# Altium schematic sheet Power_Supply.SchDoc (part 2 of 3)
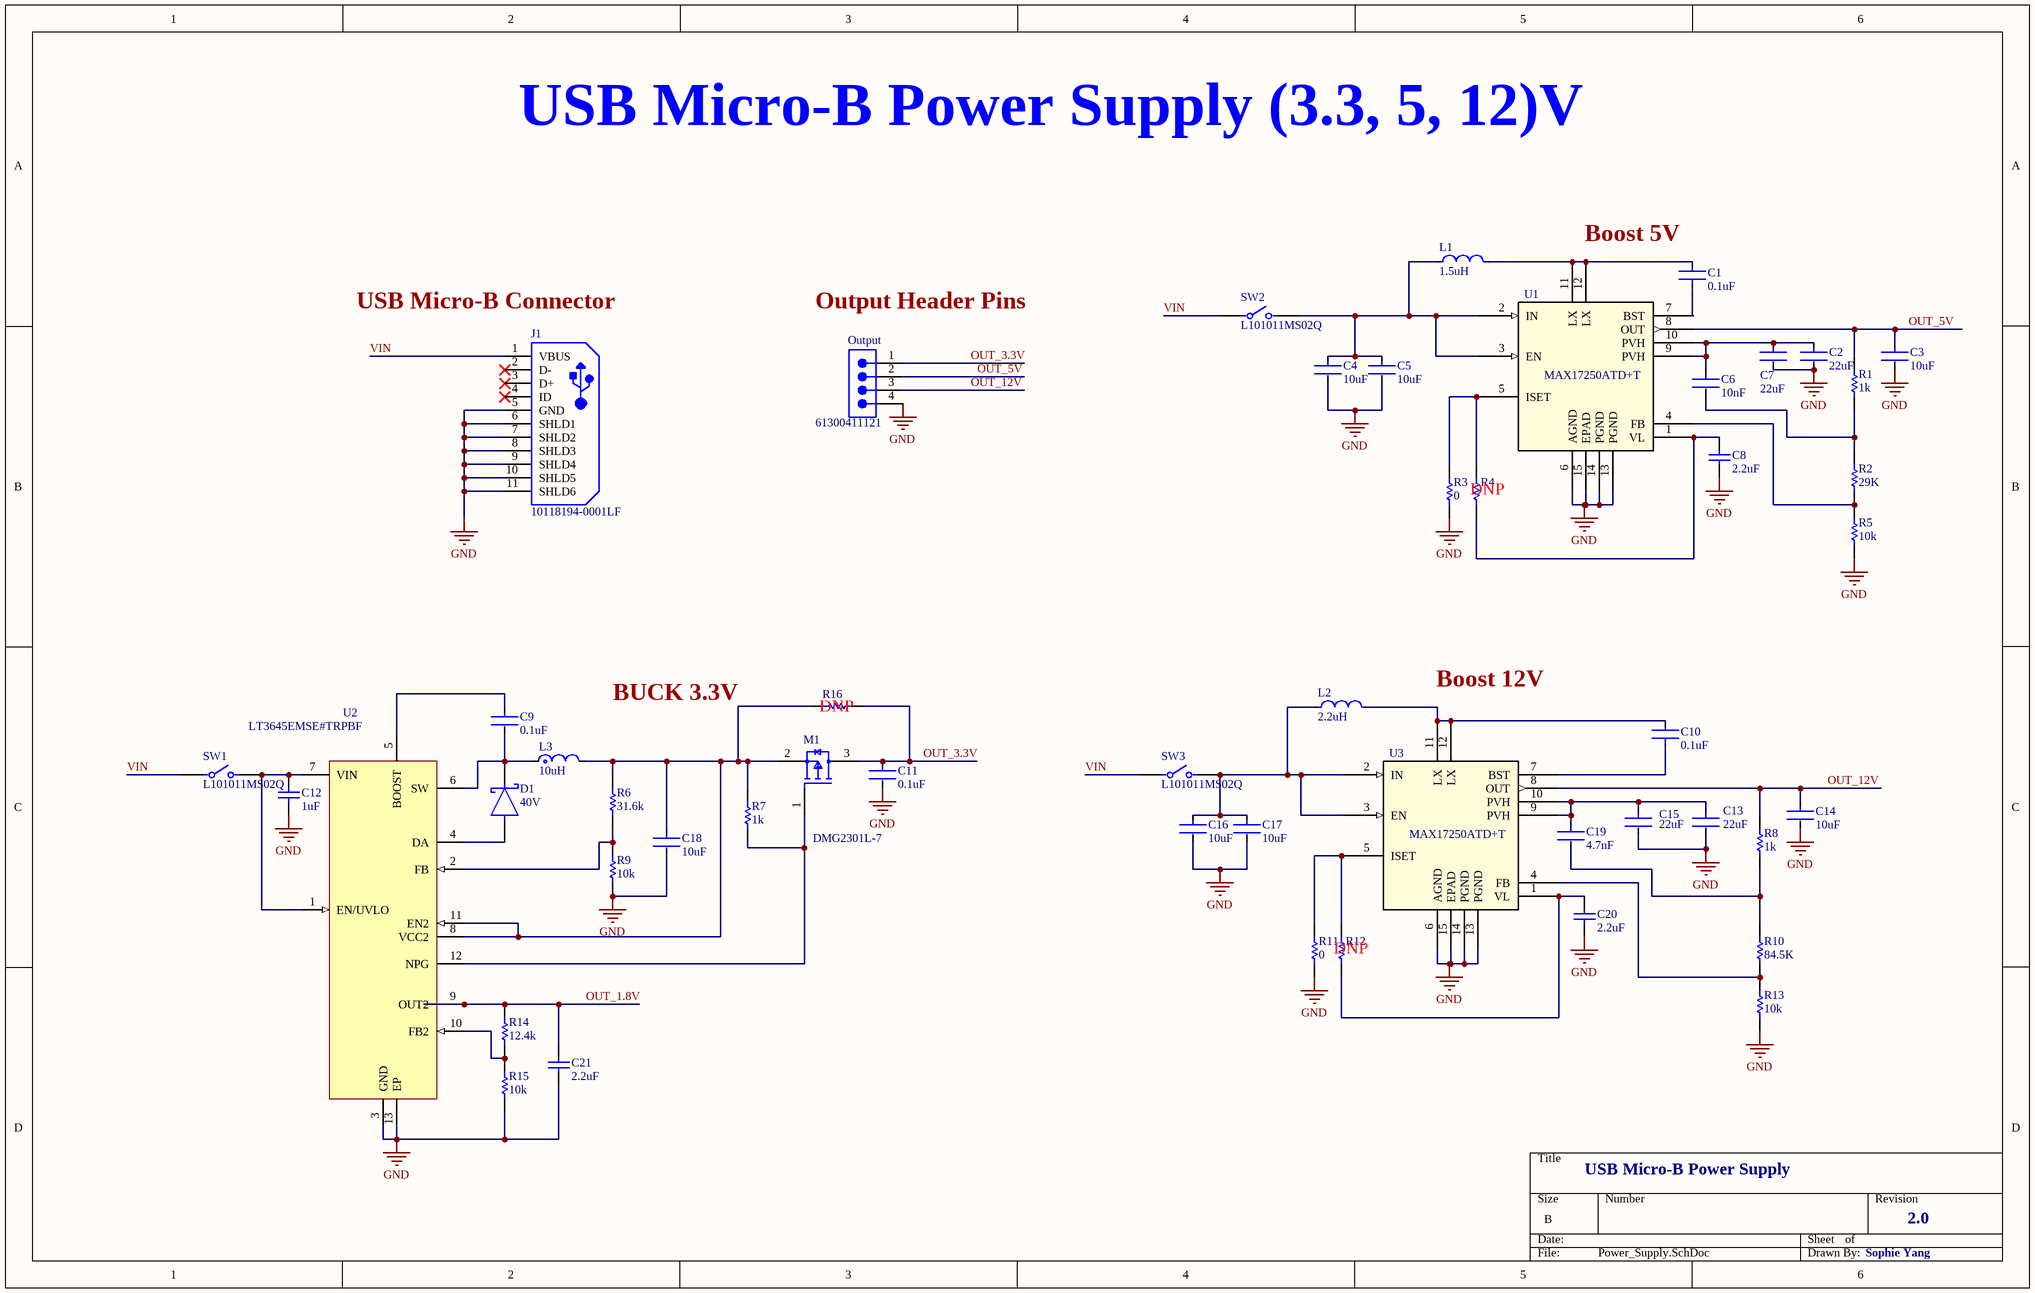
[diagram p1: Power_Supply.SchDoc]
## Library data of the parts
C1 C9-C11 = CC0805KRX7R9BB104: Ceramic Capacitor, Multilayer, Ceramic, 50V, 10% +Tol, 10% -Tol, X7R, 15% TC, 0.1uF, Surface Mount, 0805; Manufacturer: Yageo; Value: 100nF; Multilayer: Yes; Supplier: Digikey; Supplier Part Number: 311-1140-1-ND; Manufacturer Part Number: CC0805KRX7R9BB104; RoHS: Yes; Category: Ceramic Capacitors; Stock: 2371634; Pricing: 1=0.08, 10=0.027, 100=0.0192, 1000=0.0136, 4000=0.01025 (USD); Mounting Technology: Surface Mount; Pins: 2; Dielectric Material: Ceramic; Package Shape: Rectangular; Case/Package: 0805; Terminal Finish: Nickel; Min Operating Temperature: -55°C; Max Operating Temperature: 125°C; JESD-609 Code: e3; Capacitor Type: Ceramic; Tolerance  (fill in as +-): 10%; Package Style: SMTMeter; Packaging: Tape and Reel; Tolerance (fill in as +-): 10%; Rated DC Voltage (URdc): 50V; Temperature Characteristics Code: X7R; Termination: Wraparound; Length: 2mm; Width: 1.25mm; Height: 0.85mm; Reach SVHC Compliant: Yes; RoHS Compliant: Yes; ComponentLink1URL: https://datasheet.ciiva.com:443/pdfs/VipMasterIC/IC/YAGO/YAGO-S-A0003557223/YAGO-S-A0003557223-1.pdf?src-supplier=IHS+Markit; ComponentLink1Description: https://datasheet.ciiva.com:443/pdfs/VipMasterIC/IC/YAGO/YAGO-S-A0003557223/YAGO-S-A0003557223-1.pdf?src-supplier=IHS+Markit; ComponentLink2URL: https://datasheet.ciiva.com/11786/0900766b80d84f1d-11786009.pdf?src-supplier=Rs; ComponentLink2Description: https://datasheet.ciiva.com/11786/0900766b80d84f1d-11786009.pdf?src-supplier=Rs; ComponentLink3URL: https://datasheet.ciiva.com/155/mlccorderingcode-155929.pdf?src-supplier=Digikey; ComponentLink3Description: https://datasheet.ciiva.com/155/mlccorderingcode-155929.pdf?src-supplier=Digikey; ComponentLink4URL: https://datasheet.ciiva.com/155/mlccorderingcode-155930.pdf?src-supplier=Digikey; ComponentLink4Description: https://datasheet.ciiva.com/155/mlccorderingcode-155930.pdf?src-supplier=Digikey; ComponentLink5URL: https://datasheet.ciiva.com/155/mlccorderingcode-155931.pdf?src-supplier=Digikey; ComponentLink5Description: https://datasheet.ciiva.com/155/mlccorderingcode-155931.pdf?src-supplier=Digikey; ComponentLink6URL: https://datasheet.ciiva.com/46393/1734573-46393307.pdf?src-supplier=Element14; ComponentLink6Description: https://datasheet.ciiva.com/46393/1734573-46393307.pdf?src-supplier=Element14; ComponentLink7URL: https://datasheet.ciiva.com/28450/1489800-28450805.pdf?src-supplier=Element14; ComponentLink7Description: https://datasheet.ciiva.com/28450/1489800-28450805.pdf?src-supplier=Element14; ComponentLink8URL: https://datasheet.ciiva.com/29242/445210-da-01-en-kerko-chip-0805-x7r-0-1uf-10proz-50vg-29242074.pdf?src-supplier=Conrad; ComponentLink8Description: https://datasheet.ciiva.com/29242/445210-da-01-en-kerko-chip-0805-x7r-0-1uf-10proz-50vg-29242074.pdf?src-supplier=Conrad; LCSC Part Number: C49678; Supplier 1: Digikey; Supplier Part Number 1: 311-1140-1-ND
C2 C7 = GRM21BR61C226ME44L: CAP CER 22UF 16V X5R 0805; Manufacturer: Murata; Dielectric Material: Ceramic; Multilayer: Yes; Tolerance  (fill in as +-): 20%; Supplier: Digikey; Supplier Part Number: 490-10747-1-ND; Manufacturer Part Number: GRM21BR61C226ME44L; RoHS: Yes; Category: Ceramic Capacitors; Stock: 146152; Pricing: 1=0.31, 10=0.182, 100=0.1179, 1000=0.0846, 3000=0.07641, 6000=0.07158, 9000=0.06916, 15000=0.06648, 21000=0.06491, 30000=0.06341, 75000=0.06016, 150000=0.0582 (USD); Mounting Technology: Surface Mount; Pins: 2; Package Shape: Rectangular; Case/Package: 0805; Terminal Finish: Nickel; Min Operating Temperature: -55°C; Max Operating Temperature: 85°C; JESD-609 Code: e3; Value: 22uF; Capacitor Type: Ceramic; Package Style: SMTMeter; Packaging: Tape and Reel; Tolerance (fill in as +-): 20%; Rated DC Voltage (URdc): 16V; Temperature Characteristics Code: X5R; Termination: Wraparound; Length: 2mm; Width: 1.25mm; Height: 1.25mm; Reach SVHC Compliant: Yes; RoHS Compliant: Yes; ComponentLink1URL: https://datasheet.ciiva.com:443/pdfs/VipMasterIC/IC/MURE/MURE-S-A0004349797/MURE-S-A0004361391-1.pdf?src-supplier=IHS+Markit; ComponentLink1Description: https://datasheet.ciiva.com:443/pdfs/VipMasterIC/IC/MURE/MURE-S-A0004349797/MURE-S-A0004361391-1.pdf?src-supplier=IHS+Markit; ComponentLink2URL: http://www.farnell.com/datasheets/2189139.pdf?src-supplier=Farnell; ComponentLink2Description: http://www.farnell.com/datasheets/2189139.pdf?src-supplier=Farnell; ComponentLink3URL: http://www.mouser.com/ds/2/281/c02e-2905.pdf?src-supplier=Mouser; ComponentLink3Description: http://www.mouser.com/ds/2/281/c02e-2905.pdf?src-supplier=Mouser; ComponentLink4URL: http://www.farnell.com/datasheets/2189139.pdf?src-supplier=Element14; ComponentLink4Description: http://www.farnell.com/datasheets/2189139.pdf?src-supplier=Element14; ComponentLink5URL: http://www.farnell.com/datasheets/2189139.pdf?src-supplier=Newark; ComponentLink5Description: http://www.farnell.com/datasheets/2189139.pdf?src-supplier=Newark; ComponentLink6URL: https://datasheet.octopart.com/GRM21BR61C226ME44L-Murata-datasheet-68590480.pdf?src-supplier=Newark; ComponentLink6Description: https://datasheet.octopart.com/GRM21BR61C226ME44L-Murata-datasheet-68590480.pdf?src-supplier=Newark; ComponentLink7URL: https://search.murata.co.jp/Ceramy/image/img/A01X/G101/ENG/GRM21BR61C226ME44-01.pdf?src-supplier=Digikey; ComponentLink7Description: https://search.murata.co.jp/Ceramy/image/img/A01X/G101/ENG/GRM21BR61C226ME44-01.pdf?src-supplier=Digikey; ComponentLink8URL: http://psearch.en.murata.com/capacitor/product/GRM21BR61C226ME44%23.pdf?src-supplier=Avnet; ComponentLink8Description: http://psearch.en.murata.com/capacitor/product/GRM21BR61C226ME44%23.pdf?src-supplier=Avnet; ComponentLink9URL: https://datasheet.octopart.com/GRM21BR61C226ME44L-Murata-datasheet-149523492.pdf?src-supplier=Farnell; ComponentLink9Description: https://datasheet.octopart.com/GRM21BR61C226ME44L-Murata-datasheet-149523492.pdf?src-supplier=Farnell; ComponentLink10URL: https://datasheet.octopart.com/GRM21BR61C226ME44L-Murata-datasheet-79626383.pdf?src-supplier=Future+Electronics; ComponentLink10Description: https://datasheet.octopart.com/GRM21BR61C226ME44L-Murata-datasheet-79626383.pdf?src-supplier=Future+Electronics; ComponentLink11URL: https://datasheet.octopart.com/GRM21BR61C226ME44L-Murata-datasheet-165579666.pdf?src-supplier=TME; ComponentLink11Description: https://datasheet.octopart.com/GRM21BR61C226ME44L-Murata-datasheet-165579666.pdf?src-supplier=TME; LCSC Part Number: C86817; Supplier 1: Digikey; Supplier Part Number 1: 490-10747-1-ND
C3-C5 C16-C18 = GRM21BR61C106KE15K: Ceramic Capacitor, Multilayer, Ceramic, 16V, 10% +Tol, 10% -Tol, X5R, 15% TC, 10uF, Surface Mount, 0805; Manufacturer: Murata; Multilayer: Yes; Supplier: Digikey; Supplier Part Number: 490-6473-1-ND; Manufacturer Part Number: GRM21BR61C106KE15K; RoHS: Yes; Category: Ceramic Capacitors; Stock: 930907; Pricing: 1=0.14, 10=0.081, 100=0.0497, 1000=0.03306, 2500=0.0261 (USD); Mounting Technology: Surface Mount; Pins: 2; Dielectric Material: Ceramic; Package Shape: Rectangular; Case/Package: 0805; Terminal Finish: Nickel; Min Operating Temperature: -55°C; Max Operating Temperature: 85°C; JESD-609 Code: e3; Value: 10uF; Capacitor Type: Ceramic; Tolerance  (fill in as +-): 10%; Package Style: SMTMeter; Packaging: Tape and Reel; Tolerance (fill in as +-): 10%; Rated DC Voltage (URdc): 16V; Temperature Characteristics Code: X5R; Termination: Wraparound; Length: 2mm; Width: 1.25mm; Height: 1.25mm; Reach SVHC Compliant: Yes; RoHS Compliant: Yes; ComponentLink1URL: https://psearch.en.murata.com:443/capacitor/product/GRM21BR61C106KE15%23.pdf?src-supplier=IHS+Markit; ComponentLink1Description: https://psearch.en.murata.com:443/capacitor/product/GRM21BR61C106KE15%23.pdf?src-supplier=IHS+Markit; ComponentLink2URL: https://datasheet.ciiva.com/6270/partnumbering-e-01-6270407.pdf?src-supplier=Digikey; ComponentLink2Description: https://datasheet.ciiva.com/6270/partnumbering-e-01-6270407.pdf?src-supplier=Digikey; ComponentLink3URL: https://datasheet.ciiva.com/6270/partnumbering-e-01-6270410.pdf?src-supplier=Digikey; ComponentLink3Description: https://datasheet.ciiva.com/6270/partnumbering-e-01-6270410.pdf?src-supplier=Digikey; ComponentLink4URL: https://datasheet.ciiva.com/6270/partnumbering-e-01-6270412.pdf?src-supplier=Digikey; ComponentLink4Description: https://datasheet.ciiva.com/6270/partnumbering-e-01-6270412.pdf?src-supplier=Digikey; ComponentLink5URL: https://datasheet.ciiva.com/5414/product-5414934.pdf?src-supplier=Mouser; ComponentLink5Description: https://datasheet.ciiva.com/5414/product-5414934.pdf?src-supplier=Mouser; LCSC Part Number: C408141
  C3-C5 C16 C17: Supplier 1: Digikey; Supplier Part Number 1: 490-6473-1-ND
C6 = C0805C103K5RAC-TU: Ceramic Capacitor, Multilayer, Ceramic, 50V, 10% +Tol, 10% -Tol, X7R, 15% TC, 0.01uF, Surface Mount, 0805; Manufacturer: KEMET; Multilayer: Yes; Supplier: Digikey; Supplier Part Number: 399-C0805C103K5RACTUCT-ND; Manufacturer Part Number: C0805C103K5RAC-TU; RoHS: Yes; Category: Ceramic Capacitors; Stock: 1437478; Pricing: 1=0.08, 10=0.02, 50=0.0128, 100=0.0122, 4000=0.01 (USD); Mounting Technology: Surface Mount; Pins: 2; Dielectric Material: Ceramic; Package Shape: Rectangular; Case/Package: 0805; Terminal Finish: Nickel; Min Operating Temperature: -55°C; Max Operating Temperature: 125°C; JESD-609 Code: e3; Value: 10nF; Capacitor Type: Ceramic; Tolerance  (fill in as +-): 10%; Package Style: SMTMeter; Packaging: Tape and Reel; Tolerance (fill in as +-): 10%; Rated DC Voltage (URdc): 50V; Temperature Characteristics Code: X7R; Termination: Wraparound; Length: 2mm; Width: 1.25mm; Height: 0.78mm; Reach SVHC Compliant: Yes; RoHS Compliant: Yes; ComponentLink1URL: https://datasheet.ciiva.com:443/pdfs/VipMasterIC/IC/KEME/KEME-S-A0008991654/KEME-S-A0008991654-1.pdf?src-supplier=IHS+Markit; ComponentLink1Description: https://datasheet.ciiva.com:443/pdfs/VipMasterIC/IC/KEME/KEME-S-A0008991654/KEME-S-A0008991654-1.pdf?src-supplier=IHS+Markit; ComponentLink2URL: https://datasheet.ciiva.com/7842/kem-c1002-x7r-smd-7842533.pdf?src-supplier=Element14; ComponentLink2Description: https://datasheet.ciiva.com/7842/kem-c1002-x7r-smd-7842533.pdf?src-supplier=Element14; ComponentLink3URL: https://datasheet.ciiva.com/5904/kem-c1002-x7r-smd-5904709.pdf?src-supplier=Farnell; ComponentLink3Description: https://datasheet.ciiva.com/5904/kem-c1002-x7r-smd-5904709.pdf?src-supplier=Farnell; ComponentLink4URL: https://datasheet.ciiva.com/26923/getdatasheetpartid-759674-26923957.pdf?src-supplier=Verical; ComponentLink4Description: https://datasheet.ciiva.com/26923/getdatasheetpartid-759674-26923957.pdf?src-supplier=Verical; Supplier 1: Digikey; Supplier Part Number 1: 399-C0805C103K5RACTUCT-ND
C8 C20 C21 = C0805C225M8RACTU: CAP CER 2.2UF 10V X7R 0805; Manufacturer: KEMET; Dielectric Material: Ceramic; Multilayer: Yes; Tolerance  (fill in as +-): 20%; Supplier: Digikey; Supplier Part Number: 399-C0805C225M8RACTUCT-ND; Manufacturer Part Number: C0805C225M8RACTU; RoHS: Yes; Category: Ceramic Capacitors; Stock: 10401; Pricing: 1=0.22, 10=0.128, 100=0.0931, 1000=0.07388 (USD); Mounting Technology: Surface Mount; Pins: 2; Case/Package: 0805; Terminal Finish: Nickel; Package Shape: Rectangular; Min Operating Temperature: -55°C; Max Operating Temperature: 125°C; JESD-609 Code: e3; Value: 2.2uF; Capacitor Type: Ceramic; Package Style: SMTMeter; Packaging: Tape and Reel; Tolerance (fill in as +-): 20%; Rated DC Voltage (URdc): 10V; Temperature Characteristics Code: X7R; Termination: Wraparound; Length: 2mm; Width: 1.25mm; Height: 1.25mm; Reach SVHC Compliant: Yes; RoHS Compliant: Yes; ComponentLink1URL: https://datasheet.ciiva.com:443/pdfs/VipMasterIC/IC/KEME/KEME-S-A0008991654/KEME-S-A0008991654-1.pdf?src-supplier=IHS+Markit; ComponentLink1Description: https://datasheet.ciiva.com:443/pdfs/VipMasterIC/IC/KEME/KEME-S-A0008991654/KEME-S-A0008991654-1.pdf?src-supplier=IHS+Markit; ComponentLink2URL: http://www.farnell.com/datasheets/2750133.pdf?src-supplier=Farnell; ComponentLink2Description: http://www.farnell.com/datasheets/2750133.pdf?src-supplier=Farnell; ComponentLink3URL: http://www.mouser.com/ds/2/212/KEM_C1002_X7R_SMD-1102033.pdf?src-supplier=Mouser; ComponentLink3Description: http://www.mouser.com/ds/2/212/KEM_C1002_X7R_SMD-1102033.pdf?src-supplier=Mouser; ComponentLink4URL: https://api.kemet.com/component-edge/download/datasheet/C0805C225M8RACTU.pdf?src-supplier=Digikey; ComponentLink4Description: https://api.kemet.com/component-edge/download/datasheet/C0805C225M8RACTU.pdf?src-supplier=Digikey; ComponentLink5URL: https://search.kemet.com/component-edge/download/datasheet/C0805C225M8RACTU.pdf?src-supplier=Digikey; ComponentLink5Description: https://search.kemet.com/component-edge/download/datasheet/C0805C225M8RACTU.pdf?src-supplier=Digikey; ComponentLink6URL: http://www.farnell.com/datasheets/2750133.pdf?src-supplier=Newark; ComponentLink6Description: http://www.farnell.com/datasheets/2750133.pdf?src-supplier=Newark; LCSC Part Number: C2170244; Supplier 1: Digikey; Supplier Part Number 1: 399-C0805C225M8RACTUCT-ND
C12 = C0805C105K4RACTU: CAP CER 1UF 16V X7R 0805; Manufacturer: KEMET; Dielectric Material: Ceramic; Multilayer: Yes; Tolerance  (fill in as +-): 10%; Supplier: Digikey; Supplier Part Number: 399-C0805C105K4RACTUCT-ND; Manufacturer Part Number: C0805C105K4RACTU; RoHS: Yes; Category: Ceramic Capacitors; Stock: 337974; Pricing: 1=0.12, 10=0.068, 100=0.041, 1000=0.02906, 2500=0.02182, 5000=0.02051, 7500=0.02038, 12500=0.01866, 17500=0.01858, 25000=0.01823, 62500=0.01685, 125000=0.01633 (USD); Mounting Technology: Surface Mount; Pins: 2; Package Shape: Rectangular; Case/Package: 0805; Terminal Finish: Nickel; Min Operating Temperature: -55°C; Max Operating Temperature: 125°C; JESD-609 Code: e3; Value: 1uF; Capacitor Type: Ceramic; Package Style: SMTMeter; Packaging: Tape and Reel; Tolerance (fill in as +-): 10%; Rated DC Voltage (URdc): 16V; Temperature Characteristics Code: X7R; Termination: Wraparound; Length: 2mm; Width: 1.25mm; Height: 0.9mm; Reach SVHC Compliant: Yes; RoHS Compliant: Yes; ComponentLink1URL: https://datasheet.ciiva.com:443/pdfs/VipMasterIC/IC/KEME/KEME-S-A0008991654/KEME-S-A0008991654-1.pdf?src-supplier=IHS+Markit; ComponentLink1Description: https://datasheet.ciiva.com:443/pdfs/VipMasterIC/IC/KEME/KEME-S-A0008991654/KEME-S-A0008991654-1.pdf?src-supplier=IHS+Markit; ComponentLink2URL: https://datasheet.ciiva.com/6074/1722731-6074364.pdf?src-supplier=Farnell; ComponentLink2Description: https://datasheet.ciiva.com/6074/1722731-6074364.pdf?src-supplier=Farnell; ComponentLink3URL: https://datasheet.ciiva.com/14585/70095383-14585511.pdf?src-supplier=Allied+Electronics; ComponentLink3Description: https://datasheet.ciiva.com/14585/70095383-14585511.pdf?src-supplier=Allied+Electronics; ComponentLink4URL: https://datasheet.ciiva.com/14603/70095383-14603388.pdf?src-supplier=Allied+Electronics; ComponentLink4Description: https://datasheet.ciiva.com/14603/70095383-14603388.pdf?src-supplier=Allied+Electronics; ComponentLink5URL: https://datasheet.ciiva.com/28692/1851736-28692942.pdf?src-supplier=Element14; ComponentLink5Description: https://datasheet.ciiva.com/28692/1851736-28692942.pdf?src-supplier=Element14; Supplier 1: Digikey; Supplier Part Number 1: 399-C0805C105K4RACTUCT-ND
C13 C15 = GRM32ER71E226KE15L: CAP CER 22UF 25V X7R 1210; Manufacturer: Murata; Dielectric Material: Ceramic; Multilayer: Yes; Tolerance  (fill in as +-): 10%; Supplier: Digikey; Supplier Part Number: 490-5313-1-ND; Manufacturer Part Number: GRM32ER71E226KE15L; RoHS: Yes; Category: Ceramic Capacitors; Stock: 83307; Pricing: 1=0.76, 10=0.475, 100=0.33 (USD); Mounting Technology: Surface Mount; Pins: 2; Package Shape: Rectangular; Case/Package: 1210; Terminal Finish: Nickel; Min Operating Temperature: -55°C; Max Operating Temperature: 125°C; JESD-609 Code: e3; Value: 22uF; Capacitor Type: Ceramic; Package Style: SMTMeter; Packaging: Tape and Reel; Tolerance (fill in as +-): 10%; Rated DC Voltage (URdc): 25V; Temperature Characteristics Code: X7R; Termination: Wraparound; Length: 3.2mm; Width: 2.5mm; Height: 2.5mm; Reach SVHC Compliant: Yes; RoHS Compliant: Yes; ComponentLink1URL: https://datasheet.ciiva.com:443/pdfs/VipMasterIC/IC/MURE/MURES185303/MURES186124-1.pdf?src-supplier=IHS+Markit; ComponentLink1Description: https://datasheet.ciiva.com:443/pdfs/VipMasterIC/IC/MURE/MURES185303/MURES186124-1.pdf?src-supplier=IHS+Markit; ComponentLink2URL: https://datasheet.ciiva.com/6072/1697714-6072768.pdf?src-supplier=Farnell; ComponentLink2Description: https://datasheet.ciiva.com/6072/1697714-6072768.pdf?src-supplier=Farnell; ComponentLink3URL: https://datasheet.ciiva.com/3776/2741grm32er71e226ke1523-3776996.pdf?src-supplier=Arrow+Electronics; ComponentLink3Description: https://datasheet.ciiva.com/3776/2741grm32er71e226ke1523-3776996.pdf?src-supplier=Arrow+Electronics; ComponentLink4URL: https://datasheet.ciiva.com/11789/0900766b80ef921d-11789129.pdf?src-supplier=Rs; ComponentLink4Description: https://datasheet.ciiva.com/11789/0900766b80ef921d-11789129.pdf?src-supplier=Rs; ComponentLink5URL: https://datasheet.ciiva.com/16497/product-16497009.pdf?src-supplier=Future+Electronics; ComponentLink5Description: https://datasheet.ciiva.com/16497/product-16497009.pdf?src-supplier=Future+Electronics; ComponentLink6URL: https://datasheet.ciiva.com/175/partnumbering-e-01-175746.pdf?src-supplier=Digikey; ComponentLink6Description: https://datasheet.ciiva.com/175/partnumbering-e-01-175746.pdf?src-supplier=Digikey; ComponentLink7URL: https://datasheet.ciiva.com/175/partnumbering-e-01-175747.pdf?src-supplier=Digikey; ComponentLink7Description: https://datasheet.ciiva.com/175/partnumbering-e-01-175747.pdf?src-supplier=Digikey; ComponentLink8URL: https://datasheet.ciiva.com/175/partnumbering-e-01-175748.pdf?src-supplier=Digikey; ComponentLink8Description: https://datasheet.ciiva.com/175/partnumbering-e-01-175748.pdf?src-supplier=Digikey; ComponentLink9URL: https://datasheet.ciiva.com/22703/1697714-22703397.pdf?src-supplier=Element14; ComponentLink9Description: https://datasheet.ciiva.com/22703/1697714-22703397.pdf?src-supplier=Element14; LCSC Part Number: C21397; Supplier 1: Digikey; Supplier Part Number 1: 490-5313-1-ND
C14 = GRM21BZ71E106KE15L: CAP CER 10UF 25V X7R 0805; Manufacturer: Murata; Dielectric Material: Ceramic; Multilayer: Yes; Tolerance  (fill in as +-): 10%; Supplier: Digikey; Supplier Part Number: 490-GRM21BZ71E106KE15LCT-ND; Manufacturer Part Number: GRM21BZ71E106KE15L; RoHS: Yes; Category: Ceramic Capacitors; Stock: 73360; Pricing: 1=0.29, 10=0.171, 100=0.11, 1000=0.07854 (USD); Mounting Technology: Surface Mount; Pins: 2; Package Shape: Rectangular; Case/Package: 0805; Terminal Finish: Nickel; Min Operating Temperature: -55°C; Max Operating Temperature: 125°C; JESD-609 Code: e3; Value: 10uF; Capacitor Type: Ceramic; Packaging: Tape and Reel; Tolerance (fill in as +-): 10%; Rated DC Voltage (URdc): 25V; Temperature Characteristics Code: X7R; Termination: Wraparound; Reach SVHC Compliant: Yes; RoHS Compliant: Yes; ComponentLink1URL: https://datasheet.ciiva.com:443/pdfs/VipMasterIC/IC/MURE/MURE-S-A0004373697/MURE-S-A0004377414-1.pdf?src-supplier=IHS+Markit; ComponentLink1Description: https://datasheet.ciiva.com:443/pdfs/VipMasterIC/IC/MURE/MURE-S-A0004373697/MURE-S-A0004377414-1.pdf?src-supplier=IHS+Markit; ComponentLink2URL: https://datasheet.octopart.com/GRM21BZ71E106KE15L-Murata-datasheet-165579666.pdf?src-supplier=TME; ComponentLink2Description: https://datasheet.octopart.com/GRM21BZ71E106KE15L-Murata-datasheet-165579666.pdf?src-supplier=TME; LCSC Part Number: C237493; Supplier 1: Digikey; Supplier Part Number 1: 490-GRM21BZ71E106KE15LCT-ND
C19 = CC0805KRX7R9BB472: Ceramic Capacitor, Multilayer, Ceramic, 50V, 10% +Tol, 10% -Tol, X7R, 15% TC, 0.0047uF, Surface Mount, 0805; Manufacturer: Yageo; Multilayer: Yes; Supplier: Digikey; Supplier Part Number: 311-1133-1-ND; Manufacturer Part Number: CC0805KRX7R9BB472; RoHS: Yes; Category: Ceramic Capacitors; Stock: 420837; Pricing: 1=0.1, 10=0.055, 100=0.0327, 1000=0.02132 (USD); Mounting Technology: Surface Mount; Pins: 2; Dielectric Material: Ceramic; Package Shape: Rectangular; Case/Package: 0805; Terminal Finish: Nickel; Min Operating Temperature: -55°C; Max Operating Temperature: 125°C; JESD-609 Code: e3; Value: 4.7nF; Capacitor Type: Ceramic; Tolerance  (fill in as +-): 10%; Package Style: SMTMeter; Packaging: Tape and Reel; Tolerance (fill in as +-): 10%; Rated DC Voltage (URdc): 50V; Temperature Characteristics Code: X7R; Termination: Wraparound; Length: 2mm; Width: 1.25mm; Height: 0.6mm; Reach SVHC Compliant: Yes; RoHS Compliant: Yes; ComponentLink1URL: https://datasheet.ciiva.com:443/pdfs/VipMasterIC/IC/YAGO/YAGO-S-A0003557223/YAGO-S-A0003557223-1.pdf?src-supplier=IHS+Markit; ComponentLink1Description: https://datasheet.ciiva.com:443/pdfs/VipMasterIC/IC/YAGO/YAGO-S-A0003557223/YAGO-S-A0003557223-1.pdf?src-supplier=IHS+Markit; ComponentLink2URL: https://datasheet.ciiva.com/144/mlccorderingcode-144604.pdf?src-supplier=Digikey; ComponentLink2Description: https://datasheet.ciiva.com/144/mlccorderingcode-144604.pdf?src-supplier=Digikey; ComponentLink3URL: https://datasheet.ciiva.com/144/mlccorderingcode-144605.pdf?src-supplier=Digikey; ComponentLink3Description: https://datasheet.ciiva.com/144/mlccorderingcode-144605.pdf?src-supplier=Digikey; ComponentLink4URL: https://datasheet.ciiva.com/144/mlccorderingcode-144606.pdf?src-supplier=Digikey; ComponentLink4Description: https://datasheet.ciiva.com/144/mlccorderingcode-144606.pdf?src-supplier=Digikey; ComponentLink5URL: https://datasheet.ciiva.com/11464/upy-gphc-x7r-6-3v-to-50v-8-11464759.pdf?src-supplier=Avnet; ComponentLink5Description: https://datasheet.ciiva.com/11464/upy-gphc-x7r-6-3v-to-50v-8-11464759.pdf?src-supplier=Avnet; ComponentLink6URL: https://datasheet.ciiva.com/28450/1489800-28450830.pdf?src-supplier=Element14; ComponentLink6Description: https://datasheet.ciiva.com/28450/1489800-28450830.pdf?src-supplier=Element14; LCSC Part Number: C107153; Supplier 1: Digikey; Supplier Part Number 1: 311-1133-1-ND
D1 = B5819WS-TP: Rectifier Diode, Schottky, 1 Phase, 1 Element, 1A, 40V V(RRM), Silicon; Manufacturer: MCC; Package Body Material: Plastic; Number of Elements: 1; Time @ Peak Reflow Temperature-Max (s): 10s; Qualification Status: Not Qualified; Supplier: Digikey; Supplier Part Number: B5819WS-TPMSCT-ND; Manufacturer Part Number: B5819WS-TP; RoHS: Yes; Category: Rectifier Diodes; Stock: 479002; Pricing: 1=0.16, 10=0.106, 100=0.0872, 500=0.06382, 1000=0.05625, 3000=0.04242, 6000=0.04171, 9000=0.03965, 15000=0.02557 (USD); Pins: 2; Diode Element Material: SILICON; Package Shape: Rectangular; Terminal Finish: Tin; JESD-609 Code: e3; Diode Type: RECTIFIER; JESD-30 Code: R-PDSO-G2; Moisture Sensitivity Level: 1; Max Output current: 1A; Package Style: SMALL OUTLINEMeter; Peak Reflow Temperature (Cel): 260°C; Rep Pk Reverse Voltage-Max: 40V; Surface Mount: Yes; Technology: SCHOTTKY; Terminal Form: Gull Wing; Terminal Position: DUAL; Reach SVHC Compliant: Yes; RoHS Compliant: Yes; ComponentLink1URL: https://datasheet.ciiva.com:443/pdfs/VipMasterIC/IC/MCCC/MCCC-S-A0009363180/MCCC-S-A0009374855-1.pdf?src-supplier=IHS+Markit; ComponentLink1Description: https://datasheet.ciiva.com:443/pdfs/VipMasterIC/IC/MCCC/MCCC-S-A0009363180/MCCC-S-A0009374855-1.pdf?src-supplier=IHS+Markit; ComponentLink2URL: https://datasheet.ciiva.com/4715/b5817ws-b5819wssod-323-48861-4715941.pdf?src-supplier=Mouser; ComponentLink2Description: https://datasheet.ciiva.com/4715/b5817ws-b5819wssod-323-48861-4715941.pdf?src-supplier=Mouser; ComponentLink3URL: https://datasheet.ciiva.com/912/b5817ws-b5819wssod-323-912735.pdf?src-supplier=Digikey; ComponentLink3Description: https://datasheet.ciiva.com/912/b5817ws-b5819wssod-323-912735.pdf?src-supplier=Digikey; ComponentLink4URL: https://datasheet.ciiva.com/912/b5817ws-b5819wssod-323-912736.pdf?src-supplier=Digikey; ComponentLink4Description: https://datasheet.ciiva.com/912/b5817ws-b5819wssod-323-912736.pdf?src-supplier=Digikey; ComponentLink5URL: https://datasheet.ciiva.com/912/b5817ws-b5819wssod-323-912737.pdf?src-supplier=Digikey; ComponentLink5Description: https://datasheet.ciiva.com/912/b5817ws-b5819wssod-323-912737.pdf?src-supplier=Digikey; ComponentLink6URL: https://datasheet.ciiva.com/15200/getdatasheetpartid-184930-15200423.pdf?src-supplier=Verical; ComponentLink6Description: https://datasheet.ciiva.com/15200/getdatasheetpartid-184930-15200423.pdf?src-supplier=Verical; Supplier 1: Digikey; Supplier Part Number 1: B5819WS-TPMSCT-ND
J1 = 10118194-0001LF: CONN RCPT USB2.0 MICRO B SMD R/A; Manufacturer: Amphenol ICC / FCI; Supplier: Digikey; Supplier Part Number: 609-4618-1-ND; Manufacturer Part Number: 10118194-0001LF; RoHS: No; Category: LDO; Stock: 22163; Pricing: 1=0.43, 10=0.367, 25=0.3436, 50=0.3272, 100=0.3116, 250=0.29204, 500=0.27808 (USD); Supplier 1: Digikey; Supplier Part Number 1: 609-4618-1-ND
L1 = IHLP2020CZER1R5M11: FIXED IND 1.5UH 7.5A 18.5MOHM SM; Manufacturer: Vishay Dale; Supplier: Digikey; Supplier Part Number: 541-1235-1-ND; Manufacturer Part Number: IHLP2020CZER1R5M11; RoHS: No; Category: Fixed Inductors; Stock: 8329; Pricing: 1=1, 10=0.821, 100=0.6749, 1000=0.5728 (USD); ComponentLink1URL: https://datasheet.ciiva.com:443/pdfs/VipMasterIC/IC/VISH/VISH-S-A0003530167/VISH-S-A0003530167-1.pdf?src-supplier=IHS+Markit; ComponentLink1Description: https://datasheet.ciiva.com:443/pdfs/VipMasterIC/IC/VISH/VISH-S-A0003530167/VISH-S-A0003530167-1.pdf?src-supplier=IHS+Markit; ComponentLink2URL: https://datasheet.ciiva.com/11798/0900766b8102c930-11798359.pdf?src-supplier=Rs; ComponentLink2Description: https://datasheet.ciiva.com/11798/0900766b8102c930-11798359.pdf?src-supplier=Rs; ComponentLink3URL: https://datasheet.ciiva.com/1051/lp20cz11-1051639.pdf?src-supplier=Digikey; ComponentLink3Description: https://datasheet.ciiva.com/1051/lp20cz11-1051639.pdf?src-supplier=Digikey; ComponentLink4URL: https://datasheet.ciiva.com/1051/lp20cz11-1051640.pdf?src-supplier=Digikey; ComponentLink4Description: https://datasheet.ciiva.com/1051/lp20cz11-1051640.pdf?src-supplier=Digikey; ComponentLink5URL: https://datasheet.ciiva.com/1051/lp20cz11-1051641.pdf?src-supplier=Digikey; ComponentLink5Description: https://datasheet.ciiva.com/1051/lp20cz11-1051641.pdf?src-supplier=Digikey; ComponentLink6URL: https://datasheet.ciiva.com/8017/480942-8017214.pdf?src-supplier=Element14; ComponentLink6Description: https://datasheet.ciiva.com/8017/480942-8017214.pdf?src-supplier=Element14; ComponentLink7URL: https://datasheet.ciiva.com/4956/lp20cz11-270739-4956454.pdf?src-supplier=Mouser; ComponentLink7Description: https://datasheet.ciiva.com/4956/lp20cz11-270739-4956454.pdf?src-supplier=Mouser; ComponentLink8URL: https://datasheet.ciiva.com/16390/lp20cz11-16390406.pdf?src-supplier=Future+Electronics; ComponentLink8Description: https://datasheet.ciiva.com/16390/lp20cz11-16390406.pdf?src-supplier=Future+Electronics; Supplier 1: Digikey; Supplier Part Number 1: 541-1235-1-ND
L2 = IHLP2020CZER2R2M11: FIXED IND 2.2UH 6.75A 25MOHM SMD; Manufacturer: Vishay Dale; Supplier: Digikey; Supplier Part Number: 541-1236-1-ND; Manufacturer Part Number: IHLP2020CZER2R2M11; RoHS: No; Category: Fixed Inductors; Stock: 3514; Pricing: 1=0.99, 10=0.817, 100=0.6721, 1000=0.57017 (USD); RoHS Compliant: No; ComponentLink1URL: https://datasheet.ciiva.com:443/pdfs/VipMasterIC/IC/VISH/VISH-S-A0003530167/VISH-S-A0003530167-1.pdf?src-supplier=IHS+Markit; ComponentLink1Description: https://datasheet.ciiva.com:443/pdfs/VipMasterIC/IC/VISH/VISH-S-A0003530167/VISH-S-A0003530167-1.pdf?src-supplier=IHS+Markit; ComponentLink2URL: https://datasheet.ciiva.com/11798/0900766b8102c930-11798352.pdf?src-supplier=Rs; ComponentLink2Description: https://datasheet.ciiva.com/11798/0900766b8102c930-11798352.pdf?src-supplier=Rs; ComponentLink3URL: https://datasheet.ciiva.com/46385/480942-46385615.pdf?src-supplier=Element14; ComponentLink3Description: https://datasheet.ciiva.com/46385/480942-46385615.pdf?src-supplier=Element14; ComponentLink4URL: https://datasheet.ciiva.com/1051/lp20cz11-1051642.pdf?src-supplier=Digikey; ComponentLink4Description: https://datasheet.ciiva.com/1051/lp20cz11-1051642.pdf?src-supplier=Digikey; ComponentLink5URL: https://datasheet.ciiva.com/1051/lp20cz11-1051643.pdf?src-supplier=Digikey; ComponentLink5Description: https://datasheet.ciiva.com/1051/lp20cz11-1051643.pdf?src-supplier=Digikey; ComponentLink6URL: https://datasheet.ciiva.com/1051/lp20cz11-1051644.pdf?src-supplier=Digikey; ComponentLink6Description: https://datasheet.ciiva.com/1051/lp20cz11-1051644.pdf?src-supplier=Digikey; ComponentLink7URL: https://datasheet.ciiva.com/24205/lp20cz11-24205966.pdf?src-supplier=Future+Electronics; ComponentLink7Description: https://datasheet.ciiva.com/24205/lp20cz11-24205966.pdf?src-supplier=Future+Electronics; Supplier 1: Digikey; Supplier Part Number 1: 541-1236-1-ND
L3 = VLS6045EX-100M: FIXED IND 10UH 3.4A 61 MOHM SMD; Manufacturer: TDK; Core Material: Ferrite; Tolerance: 20%; Case/Size Code: 2424; DC Resistance (DCR): 47mR; Inductor Application: POWER INDUCTOR; Inductor Type: GENERAL PURPOSE INDUCTOR; Channels: 1; Shape/Size Description: RECTANGULAR PACKAGE; Shielding: Shielded; Test Frequency: 100kHz; Package Height: 4.5mm; Package Length: 6mm; Supplier: Digikey; Supplier Part Number: 445-173039-1-ND; Manufacturer Part Number: VLS6045EX-100M; RoHS: Yes; Category: Fixed Inductors; Stock: 125364; Pricing: 1=0.34, 10=0.284, 100=0.2333 (USD); Pins: 2; Min Operating Temperature: -40°C; Max Operating Temperature: 105°C; Construction: Rectangular; Inductance-Nom (L): 10uH; Package Style: SMTMeter; Packaging: Tape and Reel; Max Current Rating: 3.4A; Surface Mount: Yes; Terminal Placement: Dual Ended; Termination: One Surface; Package Width: 6mm; Reach SVHC Compliant: Yes; RoHS Compliant: Yes; ComponentLink1URL: https://datasheet.ciiva.com:443/pdfs/VipMasterIC/IC/TDKC/TDKC-S-A0006138306/TDKC-S-A0006138306-1.pdf?src-supplier=IHS+Markit; ComponentLink1Description: https://datasheet.ciiva.com:443/pdfs/VipMasterIC/IC/TDKC/TDKC-S-A0006138306/TDKC-S-A0006138306-1.pdf?src-supplier=IHS+Markit; ComponentLink2URL: http://www.farnell.com/datasheets/2724083.pdf?src-supplier=Farnell; ComponentLink2Description: http://www.farnell.com/datasheets/2724083.pdf?src-supplier=Farnell; ComponentLink3URL: https://media.digikey.com/pdf/Data%20Sheets/TDK%20PDFs/VLS-EX_Series_Br.pdf?src-supplier=Digikey; ComponentLink3Description: https://media.digikey.com/pdf/Data%20Sheets/TDK%20PDFs/VLS-EX_Series_Br.pdf?src-supplier=Digikey; ComponentLink4URL: https://datasheet.octopart.com/VLS6045EX-100M-TDK-datasheet-82987839.pdf?src-supplier=Newark; ComponentLink4Description: https://datasheet.octopart.com/VLS6045EX-100M-TDK-datasheet-82987839.pdf?src-supplier=Newark; ComponentLink5URL: https://product.tdk.com/info/en/catalog/datasheets/inductor_commercial_power_vls6045ex_en.pdf?ref_disty=digikey&src-supplier=Digikey; ComponentLink5Description: https://product.tdk.com/info/en/catalog/datasheets/inductor_commercial_power_vls6045ex_en.pdf?ref_disty=digikey&src-supplier=Digikey; ComponentLink6URL: http://www.farnell.com/datasheets/2724083.pdf?src-supplier=Newark; ComponentLink6Description: http://www.farnell.com/datasheets/2724083.pdf?src-supplier=Newark; ComponentLink7URL: http://www.farnell.com/datasheets/1951810.pdf?src-supplier=Element14; ComponentLink7Description: http://www.farnell.com/datasheets/1951810.pdf?src-supplier=Element14; ComponentLink8URL: https://datasheet.octopart.com/VLS6045EX-100M-TDK-datasheet-60278255.pdf?src-supplier=Future+Electronics; ComponentLink8Description: https://datasheet.octopart.com/VLS6045EX-100M-TDK-datasheet-60278255.pdf?src-supplier=Future+Electronics; Supplier 1: Digikey; Supplier Part Number 1: 445-173039-1-ND
M1 = DMG2301L-7: MOSFET P-CH 20V 3A SOT23; Manufacturer: Diodes; Supplier: Digikey; Supplier Part Number: DMG2301L-7DICT-ND; Manufacturer Part Number: DMG2301L-7; RoHS: Yes; Category: MOSFETs; Stock: 57854; Pricing: 1=0.25, 10=0.157, 100=0.0643, 3000=0.04182, 6000=0.03876, 9000=0.03075 (USD); Reach SVHC Compliant: Yes; RoHS Compliant: Yes; ComponentLink1URL: https://datasheet.ciiva.com:443/pdfs/VipMasterIC/IC/DIOD/DIOD-S-A0002497940/DIOD-S-A0002497940-1.pdf?src-supplier=IHS+Markit; ComponentLink1Description: https://datasheet.ciiva.com:443/pdfs/VipMasterIC/IC/DIOD/DIOD-S-A0002497940/DIOD-S-A0002497940-1.pdf?src-supplier=IHS+Markit; ComponentLink2URL: http://www.farnell.com/datasheets/2814385.pdf?src-supplier=Farnell; ComponentLink2Description: http://www.farnell.com/datasheets/2814385.pdf?src-supplier=Farnell; ComponentLink3URL: http://www.mouser.com/ds/2/115/DMG2301L-959562.pdf?src-supplier=Mouser; ComponentLink3Description: http://www.mouser.com/ds/2/115/DMG2301L-959562.pdf?src-supplier=Mouser; ComponentLink4URL: https://www.diodes.com/assets/Datasheets/DMG2301L.pdf?src-supplier=Digikey; ComponentLink4Description: https://www.diodes.com/assets/Datasheets/DMG2301L.pdf?src-supplier=Digikey; ComponentLink5URL: http://www.farnell.com/datasheets/2814385.pdf?src-supplier=Element14; ComponentLink5Description: http://www.farnell.com/datasheets/2814385.pdf?src-supplier=Element14; ComponentLink6URL: http://www.farnell.com/datasheets/2814385.pdf?src-supplier=Newark; ComponentLink6Description: http://www.farnell.com/datasheets/2814385.pdf?src-supplier=Newark; Supplier 1: Digikey; Supplier Part Number 1: DMG2301L-7DICT-ND
Output = 61300411121: CONN HEADER VERT 4POS 2.54MM; Manufacturer: Wurth Electronics; Connector Type: BOARD CONNECTOR; Body/Shell Style: PLUG; Contact Pattern: RECTANGULAR; Contact Resistance: 20mR; Contact Style: SQ PIN-SKT; Dielectric Withstanding Voltage (AC): 500V; Insulation Resistance: 1GR; Number Of Connectors: 1; Rated Current (Signal): 3A; Number of Contacts: 4; Body Breadth: 0.1inch; Body Length: 0.4inch; Mounting Option 1: LOCKING; Reference Standard: UL; Reliability: COMMERCIAL; Supplier: Digikey; Supplier Part Number: 732-5317-ND; Manufacturer Part Number: 61300411121; RoHS: Yes; Category: Headers and Wire Housings; Stock: 52831; Pricing: 1=0.17, 10=0.147, 25=0.1216, 50=0.1018, 100=0.0918, 1000=0.085 (USD); Mounting Technology: Board; Contact Material: Copper Alloy; Contact Finish - Mating: GOLD; Contact Finish - Termination: Gold (Au) - with Nickel (Ni) barrier; Insulation Color: Black; Insulation Material: Polybutylene; Min Operating Temperature: -40°C; Max Operating Temperature: 125°C; JESD-609 Code: e4; Contact Gender: Male; Mounting Style: STRAIGHT; Number of Rows Loaded: 1; PCB Contact Pattern: RECTANGULAR; Termination: Solder; Body Depth: 0.1inch; Mating Contact Pitch: 0.1inch; Terminal Length: 0.118inch; Terminal Pitch: 2.54mm; Reach SVHC Compliant: Yes; RoHS Compliant: Yes; ComponentLink1URL: https://datasheet.ciiva.com:443/pdfs/VipMasterIC/IC/MIDC/MIDCS07676/MIDCS07676-1.pdf?src-supplier=IHS+Markit; ComponentLink1Description: https://datasheet.ciiva.com:443/pdfs/VipMasterIC/IC/MIDC/MIDCS07676/MIDCS07676-1.pdf?src-supplier=IHS+Markit; ComponentLink2URL: https://datasheet.octopart.com/61300411121-W%C3%BCrth-Elektronik-datasheet-21154836.pdf?src-supplier=Element14; ComponentLink2Description: https://datasheet.octopart.com/61300411121-W%C3%BCrth-Elektronik-datasheet-21154836.pdf?src-supplier=Element14; ComponentLink3URL: http://www.farnell.com/cad/1737268.pdf?src-supplier=Element14; ComponentLink3Description: http://www.farnell.com/cad/1737268.pdf?src-supplier=Element14; ComponentLink4URL: https://katalog.we-online.de/em/datasheet/6130xx11121.pdf?src-supplier=Digikey; ComponentLink4Description: https://katalog.we-online.de/em/datasheet/6130xx11121.pdf?src-supplier=Digikey; Supplier 1: Digikey; Supplier Part Number 1: 732-5317-ND
R1 R7 R8 = RC0805FR-071KL: RES 1K OHM 1% 1/8W 0805; Manufacturer: Yageo; Additional Feature: LASER TRIMMABLE; Power: 125mW; Rated Temperature: 70°C; Value: 1kR; Working Voltage: 150V; Temperature Coefficient (ppm/Cel): 100; Package Height: 0.5mm; Package Length: 2mm; Package Width: 1.25mm; Supplier: Digikey; Supplier Part Number: 311-1.00KCRCT-ND; Manufacturer Part Number: RC0805FR-071KL; RoHS: Yes; Category: Chip SMD Resistors; Stock: 593132; Pricing: 1=0.1, 10=0.012, 100=0.0112, 1000=0.00714, 2500=0.00686, 5000=0.00408, 10000=0.00396, 15000=0.00374, 25000=0.00356 (USD); Mounting Technology: Surface Mount; Pins: 2; Package Shape: Rectangular; Case/Package: 0805; Terminal Finish: Nickel; Min Operating Temperature: -55°C; Max Operating Temperature: 155°C; Tolerance: 1%; JESD-609 Code: e3; Resistor Type: FIXED RESISTOR; Construction: Chip; Packaging: Tape and Reel; Technology: METAL GLAZE/THICK FILM; Termination: Wraparound; Reach SVHC Compliant: Yes; RoHS Compliant: Yes; ComponentLink1URL: https://datasheet.ciiva.com:443/pdfs/VipMasterIC/IC/YAGO/YAGO-S-A0008145938/YAGO-S-A0008145938-1.pdf?src-supplier=IHS+Markit; ComponentLink1Description: https://datasheet.ciiva.com:443/pdfs/VipMasterIC/IC/YAGO/YAGO-S-A0008145938/YAGO-S-A0008145938-1.pdf?src-supplier=IHS+Markit; LCSC Part Number: C95781; Supplier 1: Mouser; Supplier Part Number 1: 603-RC0805FR-0731K6L
R2 = CRCW080528K7FKEA: RES SMD 28.7K OHM 1% 1/8W 0805; Manufacturer: Vishay; Power: 125mW; Rated Temperature: 70°C; Value: 28.7kR; Working Voltage: 150V; Temperature Coefficient (ppm/Cel): 100; Package Height: 0.45mm; Package Length: 2mm; Package Width: 1.25mm; Reference Standard: AEC-Q200; Supplier: Digikey; Supplier Part Number: 541-28.7KCCT-ND; Manufacturer Part Number: CRCW080528K7FKEA; RoHS: Yes; Category: Chip SMD Resistors; Stock: 53696; Pricing: 1=0.1, 10=0.041, 100=0.0212, 1000=0.01254, 2500=0.01059 (USD); Mounting Technology: Surface Mount; Pins: 2; Package Shape: Rectangular; Case/Package: 0805; Terminal Finish: Nickel; Min Operating Temperature: -55°C; Max Operating Temperature: 155°C; Tolerance: 1%; JESD-609 Code: e3; Resistor Type: FIXED RESISTOR; Construction: Chip; Packaging: Tape and Reel; Technology: METAL GLAZE/THICK FILM; Termination: Wraparound; Reach SVHC Compliant: Yes; RoHS Compliant: Yes; ComponentLink1URL: https://datasheet.ciiva.com:443/pdfs/VipMasterIC/IC/VISH/VISH-S-A0007266705/VISH-S-A0007266705-1.pdf?src-supplier=IHS+Markit; ComponentLink1Description: https://datasheet.ciiva.com:443/pdfs/VipMasterIC/IC/VISH/VISH-S-A0007266705/VISH-S-A0007266705-1.pdf?src-supplier=IHS+Markit; ComponentLink2URL: https://datasheet.ciiva.com/3883/41413425s7679657n6892-3883344.pdf?src-supplier=Arrow+Electronics; ComponentLink2Description: https://datasheet.ciiva.com/3883/41413425s7679657n6892-3883344.pdf?src-supplier=Arrow+Electronics; ComponentLink3URL: https://datasheet.ciiva.com/2514/dcrcwe3-2514295.pdf?src-supplier=Digikey; ComponentLink3Description: https://datasheet.ciiva.com/2514/dcrcwe3-2514295.pdf?src-supplier=Digikey; ComponentLink4URL: https://datasheet.ciiva.com/2514/dcrcwe3-2514296.pdf?src-supplier=Digikey; ComponentLink4Description: https://datasheet.ciiva.com/2514/dcrcwe3-2514296.pdf?src-supplier=Digikey; ComponentLink5URL: https://datasheet.ciiva.com/2514/dcrcwe3-2514297.pdf?src-supplier=Digikey; ComponentLink5Description: https://datasheet.ciiva.com/2514/dcrcwe3-2514297.pdf?src-supplier=Digikey; ComponentLink6URL: https://datasheet.ciiva.com/7671/1697337-7671674.pdf?src-supplier=Element14; ComponentLink6Description: https://datasheet.ciiva.com/7671/1697337-7671674.pdf?src-supplier=Element14; ComponentLink7URL: https://datasheet.ciiva.com/7671/1697337-7671675.pdf?src-supplier=Element14; ComponentLink7Description: https://datasheet.ciiva.com/7671/1697337-7671675.pdf?src-supplier=Element14; ComponentLink8URL: https://datasheet.ciiva.com/22702/1697337-22702908.pdf?src-supplier=Element14; ComponentLink8Description: https://datasheet.ciiva.com/22702/1697337-22702908.pdf?src-supplier=Element14; ComponentLink9URL: https://datasheet.ciiva.com/3258/dcrcwe3-3258409.pdf?src-supplier=Avnet; ComponentLink9Description: https://datasheet.ciiva.com/3258/dcrcwe3-3258409.pdf?src-supplier=Avnet; ComponentLink10URL: https://datasheet.ciiva.com/3258/dcrcwe3-3258410.pdf?src-supplier=Avnet; ComponentLink10Description: https://datasheet.ciiva.com/3258/dcrcwe3-3258410.pdf?src-supplier=Avnet; ComponentLink11URL: https://datasheet.ciiva.com/22675/1847332-22675195.pdf?src-supplier=Element14; ComponentLink11Description: https://datasheet.ciiva.com/22675/1847332-22675195.pdf?src-supplier=Element14; ComponentLink12URL: https://datasheet.ciiva.com/16435/dcrcwe3-16435919.pdf?src-supplier=Future+Electronics; ComponentLink12Description: https://datasheet.ciiva.com/16435/dcrcwe3-16435919.pdf?src-supplier=Future+Electronics; ComponentLink13URL: https://datasheet.ciiva.com/5551/dcrcwe3-109170-5551989.pdf?src-supplier=Mouser; ComponentLink13Description: https://datasheet.ciiva.com/5551/dcrcwe3-109170-5551989.pdf?src-supplier=Mouser; LCSC Part Number: C3009069; Supplier 1: Digikey; Supplier Part Number 1: 541-28.7KCCT-ND
R3 R4 R11 R12 R16 = CRCW08050000Z0EA: RES SMD 0 OHM JUMPER 1/8W 0805; Manufacturer: Vishay; Value: 0mR; Power Rating: 125mW; Voltage Rating: 150V; Tolerance: 1%; Temperature Coefficient: 100ppm/°C; Supplier: Digikey; Supplier Part Number: 541-0.0ACT-ND; Manufacturer Part Number: CRCW08050000Z0EA; RoHS: Yes; Category: Chip SMD Resistors; Stock: 376832; Pricing: 1=0.1, 10=0.022, 25=0.0184, 50=0.0162, 100=0.0142, 250=0.01192, 500=0.01054, 1000=0.00936, 5000=0.00724, 10000=0.00655, 15000=0.00619, 25000=0.00579, 35000=0.00555, 50000=0.00531, 125000=0.00479, 250000=0.00446, 500000=0.00419 (USD); Case/Package: 0805; Weight: 0.000194oz; Case Code (Imperial): 0805; Case Code (Metric): 2012; Contact Plating: Tin; Min Operating Temperature: -55°C; Max Operating Temperature: 155°C; Resistor Type: Thick Film; Packaging: Tape and Reel; Package Quantity: 1; Termination: SMD/SMT; Number of Terminations: 2; Max Power Dissipation: 125mW; Features: Automotive AEC-Q200; Series: CRCW; Resistance Tolerance: 1%; Construction: Rectangular; Technology: THICK FILM; Voltage Rating (DC): 150V; Length: 2mm; Width: 0.049inch; Height: 0.45mm; Depth: 1.25mm; Radiation Hardening: No; Military Standard: Not; Lead Free: Lead Free; RoHS Compliant: Yes; Reach SVHC Compliant: Unknown; ComponentLink1URL: https://datasheet.ciiva.com/2463/dcrcwe3-2463037.pdf?src-supplier=Digikey; ComponentLink1Description: https://datasheet.ciiva.com/2463/dcrcwe3-2463037.pdf?src-supplier=Digikey; ComponentLink2URL: https://datasheet.ciiva.com/2463/dcrcwe3-2463038.pdf?src-supplier=Digikey; ComponentLink2Description: https://datasheet.ciiva.com/2463/dcrcwe3-2463038.pdf?src-supplier=Digikey; ComponentLink3URL: https://datasheet.ciiva.com/2463/dcrcwe3-2463039.pdf?src-supplier=Digikey; ComponentLink3Description: https://datasheet.ciiva.com/2463/dcrcwe3-2463039.pdf?src-supplier=Digikey; ComponentLink4URL: https://datasheet.ciiva.com/7841/1697337-7841629.pdf?src-supplier=Element14; ComponentLink4Description: https://datasheet.ciiva.com/7841/1697337-7841629.pdf?src-supplier=Element14; ComponentLink5URL: https://datasheet.ciiva.com/7841/1720486-7841839.pdf?src-supplier=Element14; ComponentLink5Description: https://datasheet.ciiva.com/7841/1720486-7841839.pdf?src-supplier=Element14; LCSC Part Number: C844934; Supplier 1: Digikey; Supplier Part Number 1: 541-0.0ACT-ND
R5 R9 R13 R15 = CRCW080510K0FKEA: RES SMD 10K OHM 1% 1/8W 0805; Manufacturer: Vishay; Power: 125mW; Rated Temperature: 70°C; Value: 10kR; Working Voltage: 150V; Temperature Coefficient (ppm/Cel): 100; Package Height: 0.45mm; Package Length: 2mm; Package Width: 1.25mm; Reference Standard: AEC-Q200; Supplier: Digikey; Supplier Part Number: 541-10.0KCCT-ND; Manufacturer Part Number: CRCW080510K0FKEA; RoHS: Yes; Category: Chip SMD Resistors; Stock: 386210; Pricing: 1=0.1, 10=0.041, 100=0.0212, 1000=0.01254, 2500=0.01088 (USD); Mounting Technology: Surface Mount; Pins: 2; Package Shape: Rectangular; Case/Package: 0805; Terminal Finish: Nickel; Min Operating Temperature: -55°C; Max Operating Temperature: 155°C; Tolerance: 1%; JESD-609 Code: e3; Resistor Type: FIXED RESISTOR; Construction: Chip; Packaging: Tape and Reel; Technology: METAL GLAZE/THICK FILM; Termination: Wraparound; Reach SVHC Compliant: Yes; RoHS Compliant: Yes; ComponentLink1URL: https://datasheet.ciiva.com:443/pdfs/VipMasterIC/IC/VISH/VISH-S-A0007266705/VISH-S-A0007266705-1.pdf?src-supplier=IHS+Markit; ComponentLink1Description: https://datasheet.ciiva.com:443/pdfs/VipMasterIC/IC/VISH/VISH-S-A0007266705/VISH-S-A0007266705-1.pdf?src-supplier=IHS+Markit; ComponentLink2URL: https://datasheet.ciiva.com/11808/0900766b80d98b26-11808216.pdf?src-supplier=Rs; ComponentLink2Description: https://datasheet.ciiva.com/11808/0900766b80d98b26-11808216.pdf?src-supplier=Rs; ComponentLink3URL: https://datasheet.ciiva.com/46394/1720486-46394381.pdf?src-supplier=Element14; ComponentLink3Description: https://datasheet.ciiva.com/46394/1720486-46394381.pdf?src-supplier=Element14; ComponentLink4URL: https://datasheet.ciiva.com/8337/dcrcwe3-8337773.pdf?src-supplier=Avnet; ComponentLink4Description: https://datasheet.ciiva.com/8337/dcrcwe3-8337773.pdf?src-supplier=Avnet; ComponentLink5URL: https://datasheet.ciiva.com/8337/dcrcwe3-8337774.pdf?src-supplier=Avnet; ComponentLink5Description: https://datasheet.ciiva.com/8337/dcrcwe3-8337774.pdf?src-supplier=Avnet; LCSC Part Number: C844937; Supplier 1: Digikey; Supplier Part Number 1: 541-10.0KCCT-ND
R6 = RC0805FR-0731K6L: RES 31.6K OHM 1% 1/8W 0805; Manufacturer: Yageo; Additional Feature: LASER TRIMMABLE; Power: 125mW; Rated Temperature: 70°C; Value: 31.6kR; Working Voltage: 150V; Temperature Coefficient (ppm/Cel): 100; Package Height: 0.5mm; Package Length: 2mm; Package Width: 1.25mm; Supplier: Digikey; Supplier Part Number: 311-31.6KCRCT-ND; Manufacturer Part Number: RC0805FR-0731K6L; RoHS: Yes; Category: Chip SMD Resistors; Stock: 207198; Pricing: 1=0.1, 10=0.012, 100=0.0092, 1000=0.00714, 5000=0.00408, 10000=0.00396, 15000=0.00374, 25000=0.00356 (USD); Mounting Technology: Surface Mount; Pins: 2; Package Shape: Rectangular; Case/Package: 0805; Terminal Finish: Nickel; Min Operating Temperature: -55°C; Max Operating Temperature: 155°C; Tolerance: 1%; JESD-609 Code: e3; Resistor Type: FIXED RESISTOR; Construction: Chip; Packaging: Tape and Reel; Technology: METAL GLAZE/THICK FILM; Termination: Wraparound; Reach SVHC Compliant: Yes; RoHS Compliant: Yes; ComponentLink1URL: https://datasheet.ciiva.com:443/pdfs/VipMasterIC/IC/YAGO/YAGO-S-A0008145938/YAGO-S-A0008145938-1.pdf?src-supplier=IHS+Markit; ComponentLink1Description: https://datasheet.ciiva.com:443/pdfs/VipMasterIC/IC/YAGO/YAGO-S-A0008145938/YAGO-S-A0008145938-1.pdf?src-supplier=IHS+Markit; ComponentLink2URL: https://datasheet.ciiva.com/11808/0900766b8106beab-11808887.pdf?src-supplier=Rs; ComponentLink2Description: https://datasheet.ciiva.com/11808/0900766b8106beab-11808887.pdf?src-supplier=Rs; ComponentLink3URL: https://datasheet.ciiva.com/12667/rc0805-12667321.pdf?src-supplier=Mouser; ComponentLink3Description: https://datasheet.ciiva.com/12667/rc0805-12667321.pdf?src-supplier=Mouser; ComponentLink4URL: https://datasheet.ciiva.com/17082/rc0805-17082746.pdf?src-supplier=Future+Electronics; ComponentLink4Description: https://datasheet.ciiva.com/17082/rc0805-17082746.pdf?src-supplier=Future+Electronics; Supplier 1: Digikey; Supplier Part Number 1: 311-31.6KCRCT-ND